# EasyEDA Pro project ProPrj_CWATCH_2025-07-30.epro, board PCB1
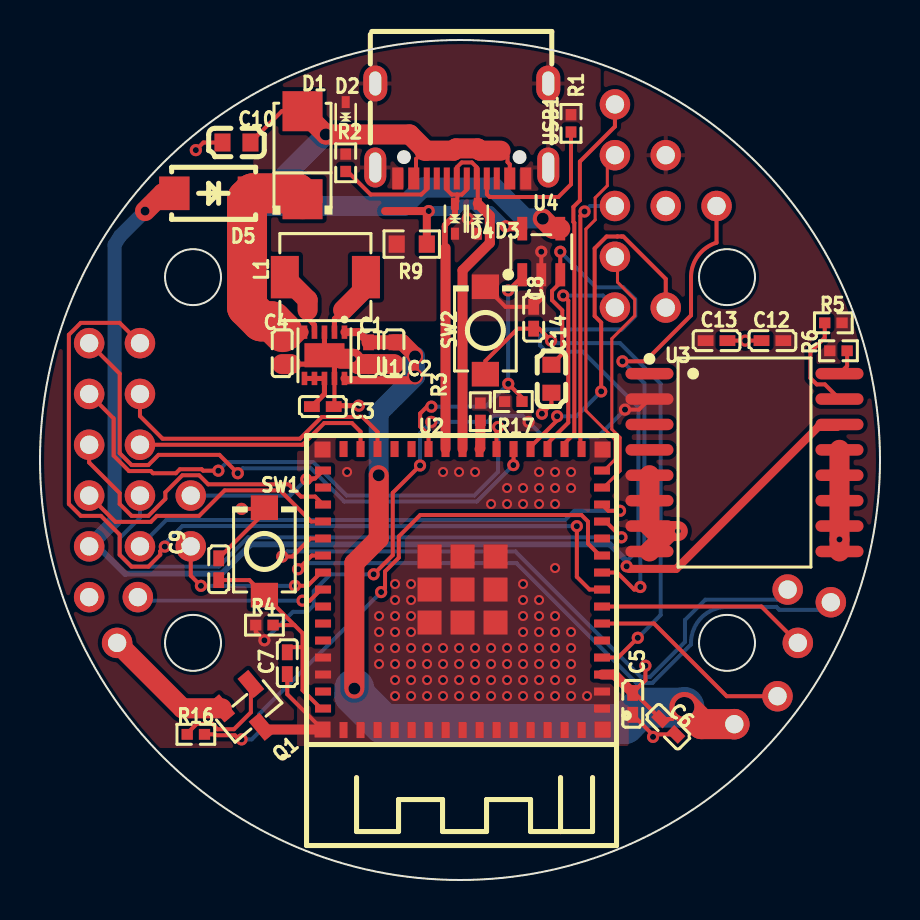
[diagram p3: board, top side]
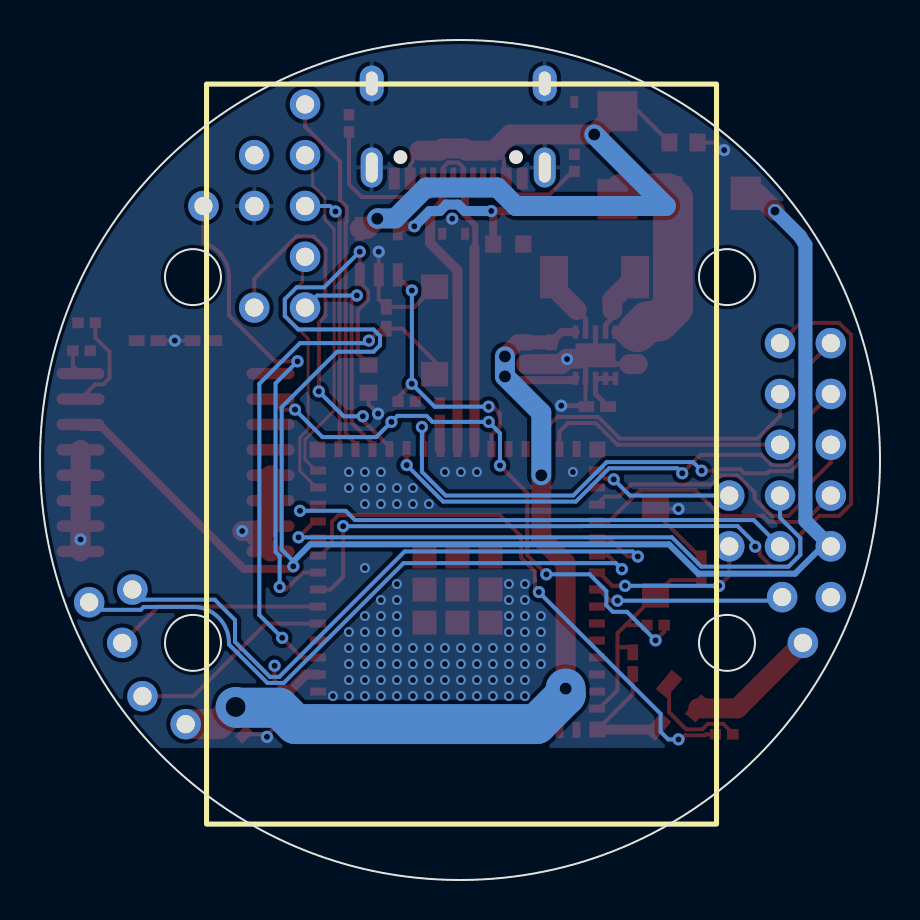
[diagram p4: board, bottom side, seen from below]

Outline 42 x 42 mm; copper layers: Top Layer, Bottom Layer. Coordinates in mm from the lower left corner of the outline.
Outline path: circle c7.65,30.14 r1.4 ; circle c7.65,11.86 r1.4 ; circle c21,21 r21 ; circle c34.35,30.14 r1.4 ; circle c34.35,11.86 r1.4
Stack: Top Layer 0.035mm / Dielectric1 1.51mm FR4 er 4.5 / Bottom Layer 0.035mm

## Design rules (mm)
template: Custom Config
spacing copperThickness1oz (default): track to track 0.102, other pairs 0.152 to 0.3
spacing copperThickness2oz: track to track 0.203, other pairs 0.152 to 0.3
track width copperThickness1oz (default): min 0.127, default 0.2, max 2.54
track width copperThickness2oz: min 0.203, default 0.254, max 2.54
differential pair differentialPair (default): width min 0.127, default 0.254, max 2.54; gap min 0.152, default 0.152
via viaSize (default): diameter min 0.5, default 0.61, max 10; hole min 0.3, default 0.305, max 6.3

## Placement (name value [footprint] x y rotation side)
C1  10uF  [C0402]  16.43 26.34 270 top
C2  10uF  [C0402]  17.7 26.34 270 top
C3  100nF  [C0402]  14.14 23.67 180 top
C4  10uF  [C0402]  12.11 26.34 90 top
C5  100nF  [C0402]  29.64 8.81 90 top
C6  10uF  [C0402]  31.41 7.67 135 top
C7  1uF  [C0402]  12.36 10.84 90 top
C8  100nF  [C0402]  24.68 28.11 270 top
C9  100nF  [C0402]  8.94 15.54 270 top
C10  10uF  [C0603]  9.82 36.88 0 top
C12  100nF  [C0402]  36.62 26.97 0 top
C13  10uF  [C0402]  33.83 26.97 180 top
C14  10uF  [C0603]  25.57 25.06 90 top
D1  SS34  [SMA_L4.3-W2.6-LS5.2-RD]  13.13 36.24 90 top
D2  LESD5D5.0CT1G  [SOD-523_L1.2-W0.8-LS1.6-BI]  15.28 38.14 270 top
D3  LESD5D5.0CT1G  [SOD-523_L1.2-W0.8-LS1.6-BI]  21.89 33.06 90 top
D4  LESD5D5.0CT1G  [SOD-523_L1.2-W0.8-LS1.6-BI]  20.75 33.06 90 top
D5  SS14  [SMA_L4.2-W2.6-LS5.0-RD_1]  8.68 34.33 180 top
L1  1.5uH  [IND-SMD_L4.4-W4.2]  14.27 30.14 180 top
NOREF  -  [Pad_e96]  37.89 11.86 0 top
NOREF#2  -  [Pad_e515]  2.46 19.22 0 top
NOREF#3  -  [Pad_e512]  2.46 26.84 0 top
NOREF#4  -  [Pad_e517]  2.46 14.14 0 top
NOREF#5  -  [Pad_e335]  28.75 38.78 0 top
NOREF#6  -  [Pad_e516]  2.46 16.68 0 top
NOREF#7  -  [Pad_e339]  28.75 28.62 0 top
NOREF#8  -  [Pad_e337]  28.75 33.7 0 top
NOREF#9  -  [Pad_e338]  28.75 31.16 0 top
NOREF#10  -  [Pad_e336]  28.75 36.24 0 top
NOREF#11  -  [Pad_e401]  7.54 19.22 0 top
NOREF#12  -  [Pad_e439]  7.54 16.68 0 top
NOREF#13  -  [Pad_e1049]  31.29 28.62 0 top
NOREF#14  -  [Pad_e520]  5 19.22 0 top
NOREF#15  -  [Pad_e521]  5 16.68 0 top
NOREF#16  -  [Pad_e513]  2.46 24.3 0 top
NOREF#17  -  [Pad_e199]  33.83 33.7 0 top
NOREF#18  -  [Pad_e514]  2.46 21.76 0 top
NOREF#19  -  [Pad_e340]  31.29 36.24 0 top
NOREF#20  -  [Pad_e2123]  5 26.84 0 top
NOREF#21  -  [Pad_e342]  31.29 33.7 0 top
NOREF#22  -  [Pad_e129]  36.88 9.19 0 top
NOREF#23  -  [Pad_e130]  34.72 7.79 0 top
NOREF#24  -  [Pad_e2113]  3.85 11.86 0 top
NOREF#25  -  [Pad_e519]  5 21.76 0 top
NOREF#26  -  [Pad_e3]  4.89 14.14 0 top
NOREF#27  -  [Pad_e518]  5 24.3 0 top
NOREF#28  -  [Pad_e131]  39.54 13.89 0 top
NOREF#29  -  [Pad_e95]  37.38 14.52 0 top
Q1  HL3402  [SOT-23-3_L2.9-W1.3-P1.90-LS2.4-BR]  10.46 8.43 130 top
R1  5.1kΩ  [R0402]  26.55 37.83 90 top
R2  5.1kΩ  [R0402]  15.28 35.86 90 top
R3  10kΩ  [R0402]  22.02 23.41 270 top
R4  10kΩ  [R0402]  11.22 12.75 0 top
R5  10kΩ  [R0402]  39.67 27.86 180 top
R6  10kΩ  [R0402]  39.92 26.46 0 top
R9  4.7kΩ  [R0603]  18.59 31.8 0 top
R16  1kΩ  [R0402]  7.79 7.28 180 top
R17  10kΩ  [R0402]  23.67 23.92 0 top
SW1  TS-1088-AR02016  [SW-SMD_L3.9-W3.0-P4.45]  11.22 16.43 90 top
SW2  TS-1088-AR02016  [SW-SMD_L3.9-W3.0-P4.45]  22.27 27.48 90 top
U1  TPS63031DSKR  [SON-10_L2.5-W2.5-P0.50-TL-EP]  14.22 26.24 270 top
U2  ESP32-S3-MINI-1-N4R2  [BULETM-SMD_ESP32-S3-MINI-1-N8]  21.13 14.52 180 top
U3  DS3231SN#T&R  [SOIC-16_L10.3-W7.5-P1.27-LS10.3-BL]  35.22 20.87 270 top
U4  MCP73831T-2ACI/OT  [SOT-23-5_L3.0-W1.7-P0.95-LS2.8-BL]  25.06 31.41 0 top
USB1  TYPE-C 16PIN 2MD(073)  [USB-C-SMD_TYPE-C-6PIN-2MD-073]  21.09 37.45 180 top

## Footprints (pads in the part's own frame, mm; a bottom-side part is the same pattern mirrored in y, then rotated)
BULETM-SMD_ESP32-S3-MINI-1-N8
  rect 0.8x0.4 smd: 1(-6.975,5.95) 2(-6.975,5.1) 3(-6.975,4.25) 4(-6.975,3.4) 5(-6.975,2.55) 6(-6.975,1.7) 7(-6.975,0.85) 8(-6.975,0) 9(-6.975,-0.85) 10(-6.975,-1.7) 11(-6.975,-2.55) 12(-6.975,-3.4) 13(-6.975,-4.25) 14(-6.975,-5.1) 15(-6.975,-5.95) 31(6.975,-5.95) 32(6.975,-5.1) 33(6.975,-4.25) 34(6.975,-3.4) 35(6.975,-2.55) 36(6.975,-1.7) 37(6.975,-0.85) 38(6.975,0) 39(6.975,0.85) 40(6.975,1.7) 41(6.975,2.55) 42(6.975,3.4) 43(6.975,4.25) 44(6.975,5.1) 45(6.975,5.95)
  rect 0.4x0.8 smd: 16(-5.95,-7.025) 17(-5.1,-7.025) 18(-4.25,-7.025) 19(-3.4,-7.025) 20(-2.55,-7.025) 21(-1.7,-7.025) 22(-0.85,-7.025) 23(0,-7.025) 24(0.85,-7.025) 25(1.7,-7.025) 26(2.55,-7.025) 27(3.4,-7.025) 28(4.25,-7.025) 29(5.1,-7.025) 30(5.95,-7.025) 46(5.95,7.025) 47(5.1,7.025) 48(4.25,7.025) 49(3.4,7.025) 50(2.55,7.025) 51(1.7,7.025) 52(0.85,7.025) 53(0,7.025) 54(-0.85,7.025) 55(-1.7,7.025) 56(-2.55,7.025) 57(-3.4,7.025) 58(-4.25,7.025) 59(-5.1,7.025) 60(-5.95,7.025)
  rect 0.8x0.8 smd: GND(-7,7) GND(-7,-7) GND(7,7) GND(7,-7)
  rect 1.2x1.2 smd: GND(-1.65,1.65) GND(-1.65,0) GND(-1.65,-1.65) GND(0,1.65) GND(0,0) GND(0,-1.65) GND(1.65,1.65) GND(1.65,0) GND(1.65,-1.65)
C0402
  rect 0.79x0.54 smd: 1(-0.545,0) 2(0.545,0)
C0603
  rect 0.8x0.9 smd: 1(-0.7,0) 2(0.7,0)
IND-SMD_L4.4-W4.2
  rect 1.4x2.12 smd: 1(2.028,0) 2(-2.028,0)
Pad_e3
  round 1.524 hole 0.914: 10(0,0)
Pad_e95
  round 1.524 hole 0.914: 1(0,0)
Pad_e96
  round 1.524 hole 0.914: 2(0,0)
Pad_e129
  round 1.524 hole 0.914: 2(0,0)
Pad_e130
  round 1.524 hole 0.914: 2(0,0)
Pad_e131
  round 1.524 hole 0.914: 2(0,0)
Pad_e199
  round 1.524 hole 0.914: 8(0,0)
Pad_e335
  round 1.524 hole 0.914: 1(0,0)
Pad_e336
  round 1.524 hole 0.914: 2(0,0)
Pad_e337
  round 1.524 hole 0.914: 3(0,0)
Pad_e338
  round 1.524 hole 0.914: 4(0,0)
Pad_e339
  round 1.524 hole 0.914: 5(0,0)
Pad_e340
  round 1.524 hole 0.914: 6(0,0)
Pad_e342
  round 1.524 hole 0.914: 8(0,0)
Pad_e401
  round 1.524 hole 0.914: 9(0,0)
Pad_e439
  round 1.524 hole 0.914: 10(0,0)
Pad_e512
  round 1.524 hole 0.914: 1(0,0)
Pad_e513
  round 1.524 hole 0.914: 2(0,0)
Pad_e514
  round 1.524 hole 0.914: 3(0,0)
Pad_e515
  round 1.524 hole 0.914: 4(0,0)
Pad_e516
  round 1.524 hole 0.914: 5(0,0)
Pad_e517
  round 1.524 hole 0.914: 6(0,0)
Pad_e518
  round 1.524 hole 0.914: 7(0,0)
Pad_e519
  round 1.524 hole 0.914: 8(0,0)
Pad_e520
  round 1.524 hole 0.914: 9(0,0)
Pad_e521
  round 1.524 hole 0.914: 10(0,0)
Pad_e1049
  round 1.524 hole 0.914: 10(0,0)
Pad_e2113
  round 1.524 hole 0.914: 1(0,0)
Pad_e2123
  round 1.524 hole 0.914: 10(0,0)
R0402
  rect 0.566x0.54 smd: 1(-0.433,0) 2(0.433,0)
R0603
  rect 0.806x0.864 smd: 1(-0.753,0) 2(0.753,0)
SMA_L4.2-W2.6-LS5.0-RD_1
  rect 1.52x1.68 smd: 1(-1.965,0) 2(1.965,0)
SMA_L4.3-W2.6-LS5.2-RD
  rect 2x2 smd: 1(-2.2,0) 2(2.2,0)
SOD-523_L1.2-W0.8-LS1.6-BI
  rect 0.6x0.4 smd: 1(-0.75,0) 2(0.75,0)
SOIC-16_L10.3-W7.5-P1.27-LS10.3-BL
  oval 0.574x2.401 smd: 1(-4.445,-4.75) 2(-3.175,-4.75) 3(-1.905,-4.75) 4(-0.635,-4.75) 5(0.635,-4.75) 6(1.905,-4.75) 7(3.175,-4.75) 8(4.445,-4.75) 9(4.445,4.75) 10(3.175,4.75) 11(1.905,4.75) 12(0.635,4.75) 13(-0.635,4.75) 14(-1.905,4.75) 15(-3.175,4.75) 16(-4.445,4.75)
SON-10_L2.5-W2.5-P0.50-TL-EP
  rect 0.665x0.28 smd: 1(-1.157,1) 2(-1.157,0.5) 3(-1.157,0) 4(-1.157,-0.5) 5(-1.157,-1) 6(1.157,-1) 7(1.157,-0.5) 8(1.157,0) 9(1.157,0.5) 10(1.157,1)
  rect 1.2x2 smd: 11(0,0)
SOT-23-3_L2.9-W1.3-P1.90-LS2.4-BR
  rect 1.25x0.7 smd: 1(1,-0.95) 2(1,0.95) 3(-1,0)
SOT-23-5_L3.0-W1.7-P0.95-LS2.8-BL
  rect 0.49x1.157 smd: 1(-0.95,-1.153) 2(0,-1.153) 3(0.95,-1.153)
  rect 0.49x1.175 smd: 4(0.95,1.153) 5(-0.95,1.153)
SW-SMD_L3.9-W3.0-P4.45
  rect 1.23x1.36 smd: 1(-2.185,0) 2(2.185,0)
USB-C-SMD_TYPE-C-6PIN-2MD-073
  rect 0.55x1.1 smd: 1(-3.2,2.375) 2(-2.4,2.375) 11(2.4,2.375) 12(3.2,2.375)
  rect 0.3x1.1 smd: 3(-1.75,2.375) 4(-1.25,2.375) 5(-0.75,2.375) 6(-0.25,2.375) 7(0.25,2.375) 8(0.75,2.375) 9(1.25,2.375) 10(1.75,2.375)
  oval 1.1x2 hole 0.6x1.5: 13(-4.325,1.825) 14(4.325,1.825)
  oval 1.2x1.8 hole 0.6x1.2: 13(-4.325,-2.375) 14(4.325,-2.375)

## Nets
3.3V: C12.2 C13.2 NOREF#19.6 R3.1 R4.1 R5.1 R6.1 R17.1 U3.2
GND: C1.2 C2.2 C3.1 C4.1 C5.1 C6.1 C7.1 C8.1 C9.1 C10.1 C12.1 C13.1 C14.1 D2.1 D3.1 D4.1 NOREF#21.8 Q1.3 R1.2 R2.2 R9.1 SW1.2 SW2.2 U1.3 U1.9 U1.11 U2.1 U2.2 U2.42 U2.43 U2.46 U2.47 U2.48 U2.49 U2.50 U2.51 U2.52 U2.53 U2.54 U2.55 U2.56 U2.57 U2.58 U2.59 U2.60 U2.GND U3.5 U3.6 U3.7 U3.8 U3.9 U3.10 U3.11 U3.12 U3.13 U4.2 USB1.1 USB1.12 USB1.13 USB1.14
PGND: NOREF#24.1 Q1.2
VBATIN: NOREF#4.6
VBUS: C10.2 D1.2 D2.2 U4.4 USB1.2 USB1.11
VIN: C4.2 D1.1 D5.1 U1.5
32KHZ: U3.1
BAT: C14.2 D5.2 NOREF#6.5 U3.14 U4.3
BCLK: NOREF#17.8 U2.9
BLA: NOREF#27.7 U2.28
CHIP-PU: C7.2 C9.2 R4.2 SW1.1 U2.45
CSO: NOREF#9.4 U2.14
D+: D4.2 U2.24 USB1.6 USB1.8
D-: D3.2 U2.23 USB1.5 USB1.7
DC: NOREF#7.5 U2.18
INT: U3.3
IO0: C8.2 SW2.1 U2.4
IO1: U2.5
IO2: NOREF#22.2 U2.6
IO3: NOREF.2 U2.7
IO4: NOREF#20.10 U2.8
IO6: R16.1 U2.10
IO7: U2.11
IO15: NOREF#13.10 U2.19
IO16: NOREF#3.1 U2.20
IO17: NOREF#16.2 U2.21
IO18: R3.2 U2.22
IO21: R17.2 U2.25 U4.1
IO35: NOREF#11.9 U2.31
IO36: U2.32
IO39: NOREF#29.1 U2.35
IO40: NOREF#28.2 U2.36
IO47: U2.27
IO48: U2.30
L_RST: NOREF#25.8 U2.29
M_3.3V: C1.1 C2.1 C5.2 C6.2 NOREF#23.2 U1.1 U1.10 U2.3
MISO: NOREF#5.1 U2.17
MOSI: NOREF#10.2 U2.15
PROG: R9.2 U4.5
RST: U3.4
SCK: NOREF#8.3 U2.16
SCL: NOREF#15.10 U2.13
SDA: NOREF#14.9 U2.12
SELECT: NOREF#26.10 U2.38
TP_INT: NOREF#2.4 U2.34
TP_RST: NOREF#18.3 U2.33
WS: NOREF#12.10 U2.37
$1N269: L1.1 U1.4
$1N274: L1.2 U1.2
$1N457: C3.2 U1.6 U1.7 U1.8
$1N1950: R2.1 USB1.10
$1N1955: R1.1 USB1.4
$1N5966: R5.2 U3.15
$1N5970: R6.2 U3.16
$1N12715: Q1.1 R16.2

Pads without a net: U2 26 39 40 41 44; USB1 3 9

## Via types
v1: diameter 0.5, hole 0.3, Top Layer to Bottom Layer, 89 vias
v2: diameter 0.61, hole 0.305, Top Layer to Bottom Layer, 49 vias
v3: diameter 0.7, hole 0.45, Top Layer to Bottom Layer, 1 via
v4: diameter 0.85, hole 0.6, Top Layer to Bottom Layer, 2 vias
v5: diameter 0.8, hole 0.6, Top Layer to Bottom Layer, 4 vias
v6: diameter 1.2, hole 1, Top Layer to Bottom Layer, 1 via

## Routing (per net, layer and track width the routed paths; a pad name or vN(x,y) marks a point on that pad's centre or on a via; arc(x,y) is an arc through that point)
3.3V: length 29.3
  Top Layer w0.2: v2(29.25,23.52) 29.94,23.52 U3.2 ; R4.1 10.79,12.42 v2(11.22,11.98) ; v2(19,20.73) 17.64,19.36 17.64,16.24 v2(16.68,15.28)
  Bottom Layer w0.2: v2(19,20.73) 19,22.34 v2(19.56,22.91) 22.37,22.91 22.67,23.21 24.13,23.21 v2(24.43,22.91) 25.19,22.14 27.87,22.14 v2(29.25,23.52) ; v2(11.22,11.98) 12.65,13.41 13.36,13.41 13.68,13.74 13.68,14.44 14.52,15.28 v2(16.68,15.28)
GND: length 44.7
  Top Layer w0.2: C7.1 12.36,9.29 U2.GND ; C14.1 25.57,23.79 v2(25.09,23.31) ; C6.1 30.77,7.28 v2(30.65,7.16) 30.65,7.25 C5.1 ; C10.1 8.17,36.88 v2(7.79,36.49) ; v2(25.06,31.41) U4.2 25.06,29.04 C8.1 23.28,28.66 SW2.2 ; 14.72,23.71 14.72,25.08 ; v2(10.08,18.56) 11.16,18.56 SW1.2 11.22,18.37 C9.1 ; C13.1 v2(35.26,26.97) C12.1
  Top Layer w0.254: v2(15.94,23.72) 14.73,23.72 C3.1 ; 12.54,25.79 13.78,25.79 U1.11 U1.3 ; 14.72,25.08 14.72,25.74 15.05,26.06
  Top Layer w0.5: Q1.3 11.24,7.52 U2.GND
  Top Layer w1: U3.9 v2(39.97,17.03) U3.10 U3.11 U3.12 U3.13 ; 31.49,17.45 30.73,17.45 U3.7 U3.6 U3.5 ; 31.49,17.45 U3.8 ; 31.49,17.45 31.89,17.45 ; 15.05,26.06 15.63,26.06 v2(15.65,26.05) 15.68,26.05 15.93,25.79 C1.2 C2.2 ; 12.54,25.79 C4.1
  vias: v1(15.35,20.4) v1(16.95,13.2) v1(16.95,12.4) v1(16.95,11.6) v1(16.95,10.8) v1(17.75,14.8) v1(17.75,14) v1(17.75,13.2) v1(17.75,12.4) v1(17.75,11.6) v1(17.75,10.8) v1(17.75,10) v1(17.75,9.2) v1(18.55,14.8) v1(18.55,14) v1(18.55,13.2) v1(18.55,12.4) v1(18.55,11.6) v1(18.55,10.8) v1(18.55,10) v1(18.55,9.2) v1(19.35,11.6) v1(19.35,10.8) v1(19.35,10) v1(19.35,9.2) v1(20.15,20.4) v1(20.15,11.6) v1(20.15,10.8) v1(20.15,10) v1(20.15,9.2) v1(20.95,20.4) v1(20.95,11.6) v1(20.95,10.8) v1(20.95,10) v1(20.95,9.2) v1(21.75,20.4) v1(21.75,11.6) v1(21.75,10.8) v1(21.75,10) v1(21.75,9.2) v1(22.55,18.8) v1(22.55,11.6) v1(22.55,10.8) v1(22.55,10) v1(22.55,9.2) v1(23.35,19.6) v1(23.35,18.8) v1(23.35,11.6) v1(23.35,10.8) v1(23.35,10) v1(23.35,9.2) v1(24.15,19.6) v1(24.15,18.8) v1(24.15,14.8) v1(24.15,14) v1(24.15,13.2) v1(24.15,12.4) v1(24.15,11.6) v1(24.15,10.8) v1(24.15,10) v1(24.15,9.2) v1(24.95,20.4) v1(24.95,19.6) v1(24.95,18.8) v1(24.95,14) v1(24.95,13.2) v1(24.95,12.4) v1(24.95,11.6) v1(24.95,10.8) v1(24.95,10) v1(24.95,9.2) v1(25.75,20.4) v1(25.75,19.6) v1(25.75,18.8) v1(25.75,15.6) v1(25.75,13.2) v1(25.75,12.4) v1(25.75,11.6) v1(25.75,10.8) v1(25.75,10) v1(25.75,9.2) v1(26.55,20.4) v1(26.55,19.6) v1(26.55,12.4) v1(26.55,11.6) v1(26.55,10.8) v1(26.55,10) v1(26.55,9.2) v1(27.35,9.2) v2(21.39,33.06) v2(31.89,17.45)
PGND: length 6.6
  Top Layer w1: NOREF#24.1 7.13,8.58 Q1.2
VBUS: length 38.9
  Top Layer w0.2: 23.12,36.43 23.38,36.18 23.38,35.9 23.49,35.78 USB1.2 ; D1.2 12.09,38.44 C10.2 ; 19.21,36.47 18.8,36.05 18.8,35.19 USB1.11
  Top Layer w1: 19.3,36.47 18.48,37.28 v4(14.29,37.28) D1.2 ; 19.3,36.47 19.21,36.47 ; 19.3,36.47 20.68,36.47 20.79,36.58 21.88,36.58 22,36.47 23.03,36.47 ; v4(25.14,33.06) 25.64,32.57 U4.4
  Bottom Layer w1: v4(25.14,33.06) 25.12,33.08 24.24,33.08 22.7,34.62 19.13,34.62 18.21,33.7 10.71,33.7 v4(14.29,37.28)
VIN: length 11.9
  Top Layer w0.6: 13.13,27.39 12.62,26.88 C4.2
  Top Layer w2: D1.1 12.83,34.33 D5.1 10.35,34.04 10.35,28.64 11.06,27.93 11.59,27.93 12.13,27.4
BAT: length 93.7
  Top Layer w0.2: v2(26.01,31.41) U4.3 26.01,29.87 25.6,29.46 25.6,28.99 26.11,28.48 26.11,26.3 C14.2
  Top Layer w0.4: v2(29.33,15.68) 29.46,15.56 31.81,15.56 38.91,22.65 39.85,22.65 U3.14
  Top Layer w1: v3(5.25,33.45) 6.14,34.33 D5.2
  Bottom Layer w0.2: v2(26.01,31.41) 27.79,29.63 29.17,29.63 29.76,29.04 29.76,28.2 29.09,27.53 25.32,27.53 25,27.2 25,26.74 25.32,26.41 27.15,26.41 29.92,23.64 29.92,16.52 29.33,15.94
  Bottom Layer w0.3: v2(29.33,15.68) 29.33,15.94 28.49,16.78 10.55,16.78 9.08,15.32 4.25,15.32 2.88,16.68 NOREF#6.5
  Bottom Layer w0.7: v3(5.25,33.45) 4.02,32.21 arc(3.87,31.99) 3.73,31.76 3.73,17.95 NOREF#6.5
BCLK: length 24.6
  Top Layer w0.2: v2(29.12,25.93) 30.25,25.93 32.55,28.23 32.55,30.14 arc(32.9,31.22) 33.83,31.87 NOREF#17.8 ; U2.9 28.86,15.37 29.71,14.52 29.89,14.52 v2(30.02,14.65)
  Bottom Layer w0.2: v2(29.12,25.93) 30.22,24.83 30.22,16.4 30.02,16.19 v2(30.02,14.65)
BLA: length 15.1
  Top Layer w0.2: NOREF#27.7 5,23.2 6.13,22.06 13,22.06 14.09,23.15 15.91,23.15 15.92,23.16 16.12,23.16 16.88,22.4 U2.28
CHIP-PU: length 11.4
  Top Layer w0.2: R4.2 12.72,12.75 ; 12.72,12.75 13.13,12.34 13.13,11.63 ; 12.72,12.75 SW1.1 10.47,14.99 C9.2 ; 12.36,11.64 13.11,11.64 13.13,11.63 ; U2.45 14.1,8.52 13.13,9.49 13.13,11.63
CSO: length 13
  Top Layer w0.15: NOREF#9.4 28.87,31.03 28.87,29.89 29.74,29.03 29.74,28.21 28.59,27.06 28.59,22.54 29.01,22.12 29.01,20.46 28.17,19.62 28.1,19.62
D+: length 15.3
  Top Layer w0.2: 20.87,34.27 20.87,33.94 D4.2 ; 20.87,34.27 20.58,34.27 20.31,34.55 20.31,35.05 20.34,35.08 ; 20.87,34.27 21.09,34.27 21.34,34.52 21.34,35.08 ; 20.28,31.6 20.29,31.62
  Top Layer w0.3: 20.24,31.68 20.24,32.66 20.24,32.67 20.24,32.74 20.75,33.24 D4.2
  Top Layer w0.5: 20.28,21.55 20.28,31.6
D-: length 16.7
  Top Layer w0.2: D3.2 21.89,35.03 USB1.5 21.84,35.63 21.59,35.88 21.08,35.88 20.84,35.63 USB1.7
  Top Layer w0.5: D3.2 22.49,33.21 22.49,31.85 21.13,30.48 U2.23
DC: length 11.1
  Top Layer w0.2: v2(26.16,29.22) 26.41,28.97 26.41,22.87 25.38,21.83 U2.18
  Bottom Layer w0.2: v2(26.16,29.22) 28.14,29.22 NOREF#7.5
IO0: length 26.6
  Top Layer w0.2: 28.1,11.12 28.9,11.12 v2(29.89,12.11) ; v2(25.56,26.97) 24.96,27.57 C8.2 23.88,27.57 22.27,25.95 SW2.1
  Bottom Layer w0.2: v2(25.56,26.97) 25.68,26.84 29,26.84 31.03,24.81 31.03,13.25 v2(29.89,12.11)
IO2: length 10.3
  Top Layer w0.2: NOREF#22.2 34.34,9.19 30.7,12.82 U2.6
IO3: length 10.5
  Top Layer w0.2: NOREF.2 36.07,13.67 U2.7
IO4: length 45.1
  Top Layer w0.2: NOREF#20.10 3.98,27.86 2.04,27.86 1.44,27.26 1.44,18.8 2.04,18.21 3.04,18.21 3.98,17.27 3.98,16.26 4.58,15.67 5.42,15.67 6.01,16.26 6.01,16.44 v2(6.24,16.67) ; U2.8 27.48,14.52 26.84,15.16 v2(26.84,17.69)
  Bottom Layer w0.2: v2(26.84,17.69) 14.91,17.69 14.91,17.7 7.12,17.7 6.24,16.82 v2(6.24,16.67)
IO6: length 27.7
  Top Layer w0.2: R16.1 8.71,7.28 8.75,7.24 9.75,7.24 9.95,7.03 ; v2(17.06,14.4) 17.25,14.59 17.25,15.43 17.94,16.12 17.94,17.18 19.01,18.25 27.07,18.25 27.4,17.92 27.4,16.82 28.04,16.17 28.05,16.17 U2.10
  Bottom Layer w0.2: v2(17.06,14.4) 10.97,8.31 10.97,7.41 10.59,7.03 v2(10.08,7.03)
IO15: length 18.3
  Top Layer w0.2: v2(28.06,24.43) 28.06,27.87 27.73,28.2 27.73,31.58 28.33,32.17 28.87,32.17 28.87,32.18 29.07,32.18 29.08,32.17 29.17,32.17 31.29,30.05 NOREF#13.10 ; U2.19 24.56,21.58 24.56,21.68 25.86,22.98 v2(25.86,23.19)
  Bottom Layer w0.2: v2(25.86,23.19) 26.82,23.19 v2(28.06,24.43)
IO16: length 29
  Top Layer w0.2: NOREF#3.1 3.98,25.32 3.98,21.34 4.58,20.75 5.42,20.75 5.93,21.26 8.97,21.26 v2(9.89,20.34) ; v2(23.67,20.75) 23.68,20.76 23.68,21.55
  Bottom Layer w0.2: v2(23.67,20.75) 21.84,18.92 15.21,18.92 13.54,20.59 10.14,20.59 v2(9.89,20.34)
IO17: length 28
  Top Layer w0.2: v2(8.92,20.47) 8.16,20.47 8.08,20.54 6.99,20.54 6.79,20.34 5.65,20.34 5.54,20.45 4.45,20.45 3.68,21.22 3.68,23.08 NOREF#16.2 ; U2.21 22.83,22.57 v2(22.91,22.65)
  Bottom Layer w0.2: v2(8.92,20.47) 9.35,20.9 13.66,20.9 15.34,19.22 21.72,19.22 22.91,20.41 v2(22.91,22.65)
IO18: length 1.4
  Top Layer w0.5: R3.2 22.02,21.59 U2.22
IO21: length 13.9
  Top Layer w0.2: U4.1 24.11,30.18 v2(23.41,29.48) ; v2(23.41,24.81) 24.1,24.12 R17.2 ; U2.25 19.43,22.25 19.01,22.67 19.01,23.33 19.35,23.67 v2(19.57,23.67)
  Bottom Layer w0.2: v2(23.41,29.48) 23.41,24.82 v2(23.41,24.81) 22.27,23.67 v2(19.57,23.67)
IO35: length 7.1
  Top Layer w0.2: U2.31 13.75,20.08 13.65,20.08 13.6,20.03 v2(13.31,20.03)
  Bottom Layer w0.2: v2(13.31,20.03) 12.5,19.22 NOREF#11.9
IO39: length 32.8
  Top Layer w0.2: v2(12.11,16.17) 12.62,16.17 13.52,17.07 U2.35
  Bottom Layer w0.2: v2(12.11,16.17) 12.36,16.43 23.77,16.43 30.04,10.16 30.5,10.16 32.25,11.9 32.25,13 33.26,14.02 36.88,14.02 NOREF#29.1
IO40: length 32.9
  Top Layer w0.2: v2(12.91,15.54) 13.59,16.22 U2.36
  Bottom Layer w0.2: v2(12.91,15.54) 13.21,15.84 23.83,15.84 29.81,9.85 30.63,9.85 32.55,11.78 arc(32.55,11.82) 32.55,11.86 arc(33.11,13.16) 34.43,13.65 36.82,13.65 36.96,13.51 39.16,13.51 NOREF#28.2
L_RST: length 12.5
  Top Layer w0.2: U2.29 16.03,22.42 15.6,22.85 14.21,22.85 13.13,21.76 NOREF#25.8
M_3.3V: length 54.1
  Top Layer w0.2: v6(32.22,8.65) 31.62,8.05 C6.2 29.73,9.35 29.64,9.35 30.27,9.99 v2(30.27,10.71)
  Top Layer w0.4: U1.1 15.92,27.39 C1.1 ; U1.10 15.31,24.99 18.56,24.99 v5(18.75,25.18) v5(18.75,26.18)
  Top Layer w0.5: U2.3 28.72,10.27 29.64,9.35
  Top Layer w0.7: C1.1 C2.1
  Top Layer w0.8: v5(18.75,26.18) 18.75,26.25 18.12,26.88 C2.1
  Top Layer w1: v5(16.94,20.24) 16.94,17.06 15.72,15.84 v5(15.72,9.57)
  Top Layer w1.5: v6(32.22,8.65) 33.08,7.79 NOREF#23.2
  Bottom Layer w1: v5(18.75,26.18) v5(18.75,25.18) 16.94,23.36 v5(16.94,20.24)
  Bottom Layer w2: v5(15.72,9.57) 15.72,9.25 17.17,7.8 29.23,7.8 30.05,8.61 32.18,8.61 v6(32.22,8.65)
MISO: length 18.3
  Top Layer w0.2: U2.17 26.23,21.83 26.72,22.32 26.72,32.86 26.67,32.91 26.67,33.66 27,33.98 27,35.92 28.75,37.67 NOREF#5.1
MOSI: length 17.3
  Top Layer w0.15: NOREF#10.2 28.37,35.86 28.37,34.72 27.76,34.11 27.76,33.01 27.29,32.55 27.29,23.47 28.24,22.52 28.25,22.52 28.75,22.02 28.75,21.03 28.2,20.47 U2.15
PROG: length 9.2
  Top Layer w0.4: 19.44,33.45 19.34,33.35 R9.2 ; 19.44,33.45 17.25,33.45 ; 19.44,33.45 v2(19.44,33.45)
  Top Layer w0.5: v2(23.29,32.68) 24,32.68 U4.5
  Bottom Layer w0.5: v2(23.29,32.68) 22.52,33.45 22.01,33.45 21.68,33.77 21.1,33.77 20.77,33.45 v2(19.44,33.45)
SCK: length 13.6
  Top Layer w0.2: v2(27.23,33.42) 27.02,33.22 27.02,21.61 U2.16
  Bottom Layer w0.2: v2(27.23,33.42) 27.5,33.7 NOREF#8.3
SCL: length 25.8
  Top Layer w0.2: U2.13 28.41,18.46 v2(29,18.46)
  Bottom Layer w0.2: NOREF#15.10 6.31,18 26.25,18 26.72,18.46 v2(29,18.46)
SDA: length 30.6
  Top Layer w0.2: v2(29.07,17.13) 28.28,17.92 U2.12
  Bottom Layer w0.2: v2(29.07,17.13) 10.4,17.13 8.94,15.67 4.58,15.67 3.98,16.26 3.98,17.1 5,18.12 NOREF#14.9
SELECT: length 9.6
  Top Layer w0.2: v2(13.13,13.97) 13.49,13.97 14.05,14.52 U2.38
  Bottom Layer w0.2: v2(13.13,13.97) 5.07,13.97 NOREF#26.10
TP_INT: length 13.5
  Top Layer w0.2: NOREF#2.4 3.77,17.91 5.54,17.91 5.84,18.21 7.96,18.21 9.23,19.48 12.01,19.48 13.56,17.92 U2.34
TP_RST: length 15.6
  Top Layer w0.2: U2.33 13.75,19.17 13.05,19.17 12.44,19.78 8.41,19.78 7.96,20.24 7.12,20.24 6.27,19.39 6.27,19.06 5.42,18.21 4.58,18.21 3.98,18.8 3.98,19.35 2.46,20.87 NOREF#18.3
WS: length 8.6
  Top Layer w0.2: v2(12.75,14.71) 13.38,14.71 14.05,15.37 U2.37 ; v2(8.05,14.71) 7.54,15.22 NOREF#12.10
  Bottom Layer w0.2: v2(12.75,14.71) v2(8.05,14.71)
$1N269: length 3.4
  Top Layer w0.254: 13.38,28.49 13.38,28.1 13.64,27.84 13.64,27.83 13.72,27.75 13.72,27.39
  Top Layer w1: L1.1 13.38,29 13.38,28.49
$1N274: length 3.4
  Top Layer w0.254: 14.72,27.39 14.72,28.06 15.16,28.5
  Top Layer w1: 15.16,28.5 16.3,29.64 L1.2
$1N457: length 2.7
  Top Layer w0.254: U1.6 U1.8 14.22,24.3 C3.2
$1N1950: length 5.2
  Top Layer w0.2: USB1.10 19.34,34.54 19.07,34.27 16.53,34.27 15.38,35.43 R2.1
$1N1955: length 7.9
  Top Layer w0.2: 26.55,37.4 26.55,34.78 25.91,34.15 22.49,34.15 22.34,34.29 22.34,35.07 USB1.4
$1N5966: length 4.9
  Top Layer w0.2: R5.2 39.24,27.12 38.52,26.4 38.52,25.09 38.84,24.78 39.24,24.78 U3.15
$1N5970: length 1.3
  Top Layer w0.2: R6.2 40.36,25.7 U3.16
$1N12715: length 5.3
  Top Layer w0.2: Q1.1 10.54,8.38 9.7,7.54 8.88,7.54 8.61,7.81 7.84,7.81 7.36,7.33 R16.2

## Copper pours and planes (outline as drawn; the poured copper is in the pictures)
3.3V on Top Layer: -9.23,55.67 55.04,55.67 55.04,-4.53 -9.23,-4.53
GND on Top Layer: 12.9,22.22 29.38,22.22 29.38,6.75 12.9,6.75
GND on Top Layer: 10.71,44.37 27.99,44.37 27.99,27.98 10.71,27.98
GND on Bottom Layer: -12.78,57.89 53.77,57.89 53.77,-3.96 -12.78,-3.96
